# Altium schematic sheet Sheet1.SchDoc
size A; SheetNumber: 1; SheetTotal: 1
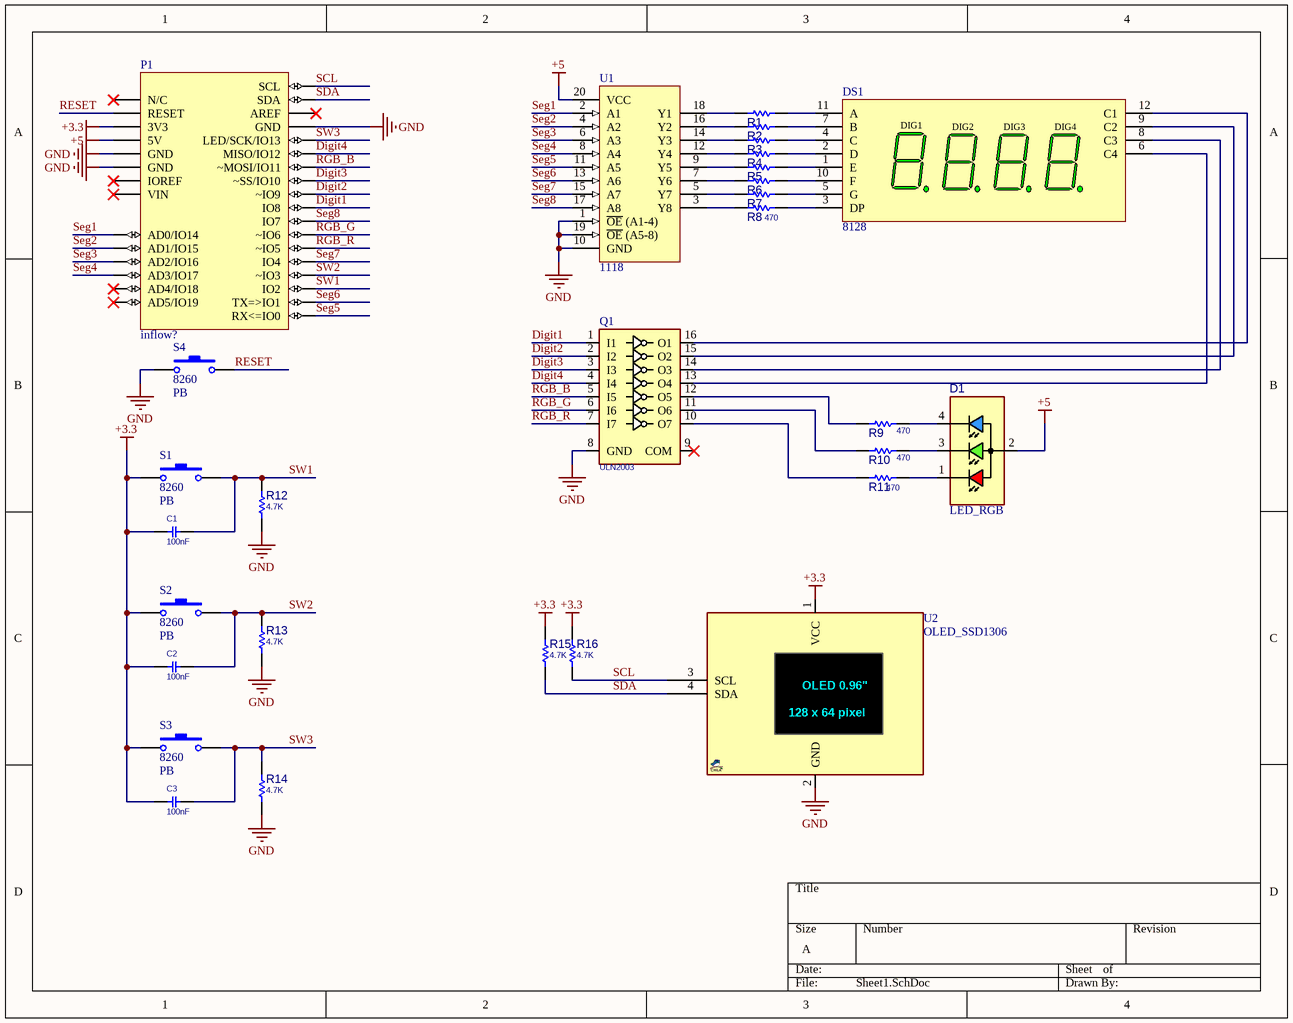
[diagram p0: Sheet1.SchDoc]

## Parts
C1  100nF  [C_CER_D3]
C2  100nF  [C_CER_D3]
C3  100nF  [C_CER_D3]
D1  LED_RGB  [LED5RGB]
DS1  Inflow: 8128  [7Seg-MPX4-30.2x14.1mm]  (hidden comment: 4Digit, Red)
P1  Inflow: inflow?  [Arduino_uno_S_3]  (hidden comment: UNO)  (no BOM)
Q1  ULN2003  [DIP_16]
R1  470  [R1206]  (value not drawn)
R2  470  [R1206]  (value not drawn)
R3  470  [R1206]  (value not drawn)
R4  470  [R1206]  (value not drawn)
R5  470  [R1206]  (value not drawn)
R6  470  [R1206]  (value not drawn)
R7  470  [R1206]  (value not drawn)
R8  470  [R1206]
R9  470  [R1206]
R10  470  [R1206]
R11  470  [R1206]
R12  4.7K  [R1206]
R13  4.7K  [R1206]
R14  4.7K  [R1206]
R15  4.7K  [R1206]
R16  4.7K  [R1206]
S1  Inflow: 8260  [SW_PB_SMD_2PIN_SPST_6X3X2]  (hidden comment: PB)
S2  Inflow: 8260  [SW_PB_SMD_2PIN_SPST_6X3X2]  (hidden comment: PB)
S3  Inflow: 8260  [SW_PB_SMD_2PIN_SPST_6X3X2]  (hidden comment: PB)
S4  Inflow: 8260  [SW_PB_SMD_2PIN_SPST_6X3X2]  (hidden comment: PB)
U1  Inflow: 1118  [PDIP20]  (hidden comment: 74HCT244)
U2  OLED_SSD1306  [OLED_SSD1306_64_I2C]

## Nets
+3.3: C1.1 C2.1 C3.1 P1.4(3V3) R15.2 R16.2 S1.1 S2.1 S3.1 U2.1(VCC)
+5: D1.2(C) P1.5(5V) U1.20(VCC)
GND: P1.6(GND) P1.7(GND) P1.29(GND) Q1.8(GND) R12.1 R13.1 R14.1 S4.1 U1.1(~{OE}_(A1-4)) U1.10(GND) U1.19(~{OE}_(A5-8)) U2.2(GND)
Digit1: P1.23(IO8) Q1.1(I1)
Digit2: P1.24(~IO9) Q1.2(I2)
Digit3: P1.25(~SS/IO10) Q1.3(I3)
Digit4: P1.27(MISO/IO12) Q1.4(I4)
RESET: P1.3(RESET) S4.2
RGB_B: P1.26(~MOSI/IO11) Q1.5(I5)
RGB_G: P1.21(~IO6) Q1.6(I6)
RGB_R: P1.20(~IO5) Q1.7(I7)
SCL: P1.32(SCL) R16.1 U2.3(SCL)
SDA: P1.31(SDA) R15.1 U2.4(SDA)
Seg1: P1.9(AD0/IO14) U1.2(A1)
Seg2: P1.10(AD1/IO15) U1.4(A2)
Seg3: P1.11(AD2/IO16) U1.6(A3)
Seg4: P1.12(AD3/IO17) U1.8(A4)
Seg5: P1.15(RX<=IO0) U1.11(A5)
Seg6: P1.16(TX=>IO1) U1.13(A6)
Seg7: P1.19(IO4) U1.15(A7)
Seg8: P1.22(IO7) U1.17(A8)
SW1: C1.2 P1.17(IO2) R12.2 S1.2
SW2: C2.2 P1.18(~IO3) R13.2 S2.2
SW3: C3.2 P1.28(LED/SCK/IO13) R14.2 S3.2
NetD1_1: D1.1(RED) R11.2
NetD1_3: D1.3(GRN) R10.2
NetD1_4: D1.4(BLU) R9.2
NetDS1_1: DS1.1(E) R5.2
NetDS1_2: DS1.2(D) R4.2
NetDS1_3: DS1.3(DP) R8.2
NetDS1_4: DS1.4(C) R3.2
NetDS1_5: DS1.5(G) R7.2
NetDS1_6: DS1.6(C4) Q1.13(O4)
NetDS1_7: DS1.7(B) R2.2
NetDS1_8: DS1.8(C3) Q1.14(O3)
NetDS1_9: DS1.9(C2) Q1.15(O2)
NetDS1_10: DS1.10(F) R6.2
NetDS1_11: DS1.11(A) R1.2
NetDS1_12: DS1.12(C1) Q1.16(O1)
NetQ1_10: Q1.10(O7) R11.1
NetQ1_11: Q1.11(O6) R10.1
NetQ1_12: Q1.12(O5) R9.1
NetR1_1: R1.1 U1.18(Y1)
NetR2_1: R2.1 U1.16(Y2)
NetR3_1: R3.1 U1.14(Y3)
NetR4_1: R4.1 U1.12(Y4)
NetR5_1: R5.1 U1.9(Y5)
NetR6_1: R6.1 U1.7(Y6)
NetR7_1: R7.1 U1.5(Y7)
NetR8_1: R8.1 U1.3(Y8)

Not connected (* = marked no-connect by the designer): P1 1(N/C)* 2(IOREF)* 8(VIN)* 13(AD4/IO18)* 14(AD5/IO19)* 30(AREF)*; Q1 9(COM)*

## Notes on the sheet
- (in symbol ModSen_7Seg_MPX4_CC) DIG1; DIG2; DIG3; DIG4
- (in symbol OLED_SSD1306_64_I2C) OLED 0.96"; 128 x 64 pixel

## Library data of the parts
C1-C3 = CAP_THD_CERML: CAP, THD, CER MULTI LAYER,; PARAM: 50V; DESC: CAP, CER MULTI LAYER,; MANF_P#: MANF_PART#; PRICE: 100= 1$; MANF: MANF; PARAM2: PARAM2; ASSEMBLY: ASSEMBLY; VALUE: 100nF
D1 = LED_THD_5MM_RGB_CA: LED, THD, 5MM, RGB COMMON CATHODE; MANF_P#: YSL-R596CR3G4B5C-C10; MANF: CHINA YOUNG; DESC: DESCRIPTION; ASSEMBLY: ASSEMBLY; PRICE: PRICE; VALUE: LED_RGB
DS1 = ModSen_7Seg_MPX4_CC: 7Segment-MPX4-CC; Rating: Rating?; Type: Type?; Value: 4Digit, Red; Package: Package?
P1 = Con_Arduino_UNO_S: Arduino uno slave; Rating: Rating?; Value: UNO; Package: Package?; Type: Type?
Q1 = ULN2003_DIP16: Darlington, 7-CH, 50V, 0.5A; MANF_P#: ULN2003A; MANF: DIODES; PARAM: 7-CH, 50V, 0.5A; PARAM2: -; VALUE: ULN2003
R1-R16 = RES_SMD_1206: RESISTOR, SMD; PARAM: -W; DESC: DESCRIPTION; DIST#: MOUSER; PARAM2: 1%; MANF_P#: -; MANF: -; ASSEMBLY: ASSEMBLY; PRICE: 100= 0.5$
  R1-R11: VALUE: 470
  R12-R16: VALUE: 4.7K
S1-S4 = SW_PushButton_2_SMD: SMT Tactile ‎Switch; Rating: 2b; Type: Vertical; Package: SMD; Value: PB
U1 = IC_Logic_74HCT244: Octal Bus Buffer with 3 State Outputs (Non Inverted); Rating: 8b; Type: 3-State Non-Inverting; Package: Dip; Value: 74HCT244
U2 = OLED_SSD1306_64_I2C: OLED, SSD1306, 0.96", 128X64, BREAKOUT I2C; MANF_P#: OLED_SSD1306_I2C; PARAM2: 3.3/5VCC, -20~70oC; PARAM: 2 Colors, 0.96", 128X64; MANF: -; VALUE: OLED_SSD1306